# EasyEDA schematic SCH_Universal_Endstop_ZAxis Dumb_2023-11-13.json
TITLE: Sheet_1; REV: 1.0; Date: 2022-06-12; Sheet: 1/1; Drawn By: Edward Niedziejko; Company: Your Company
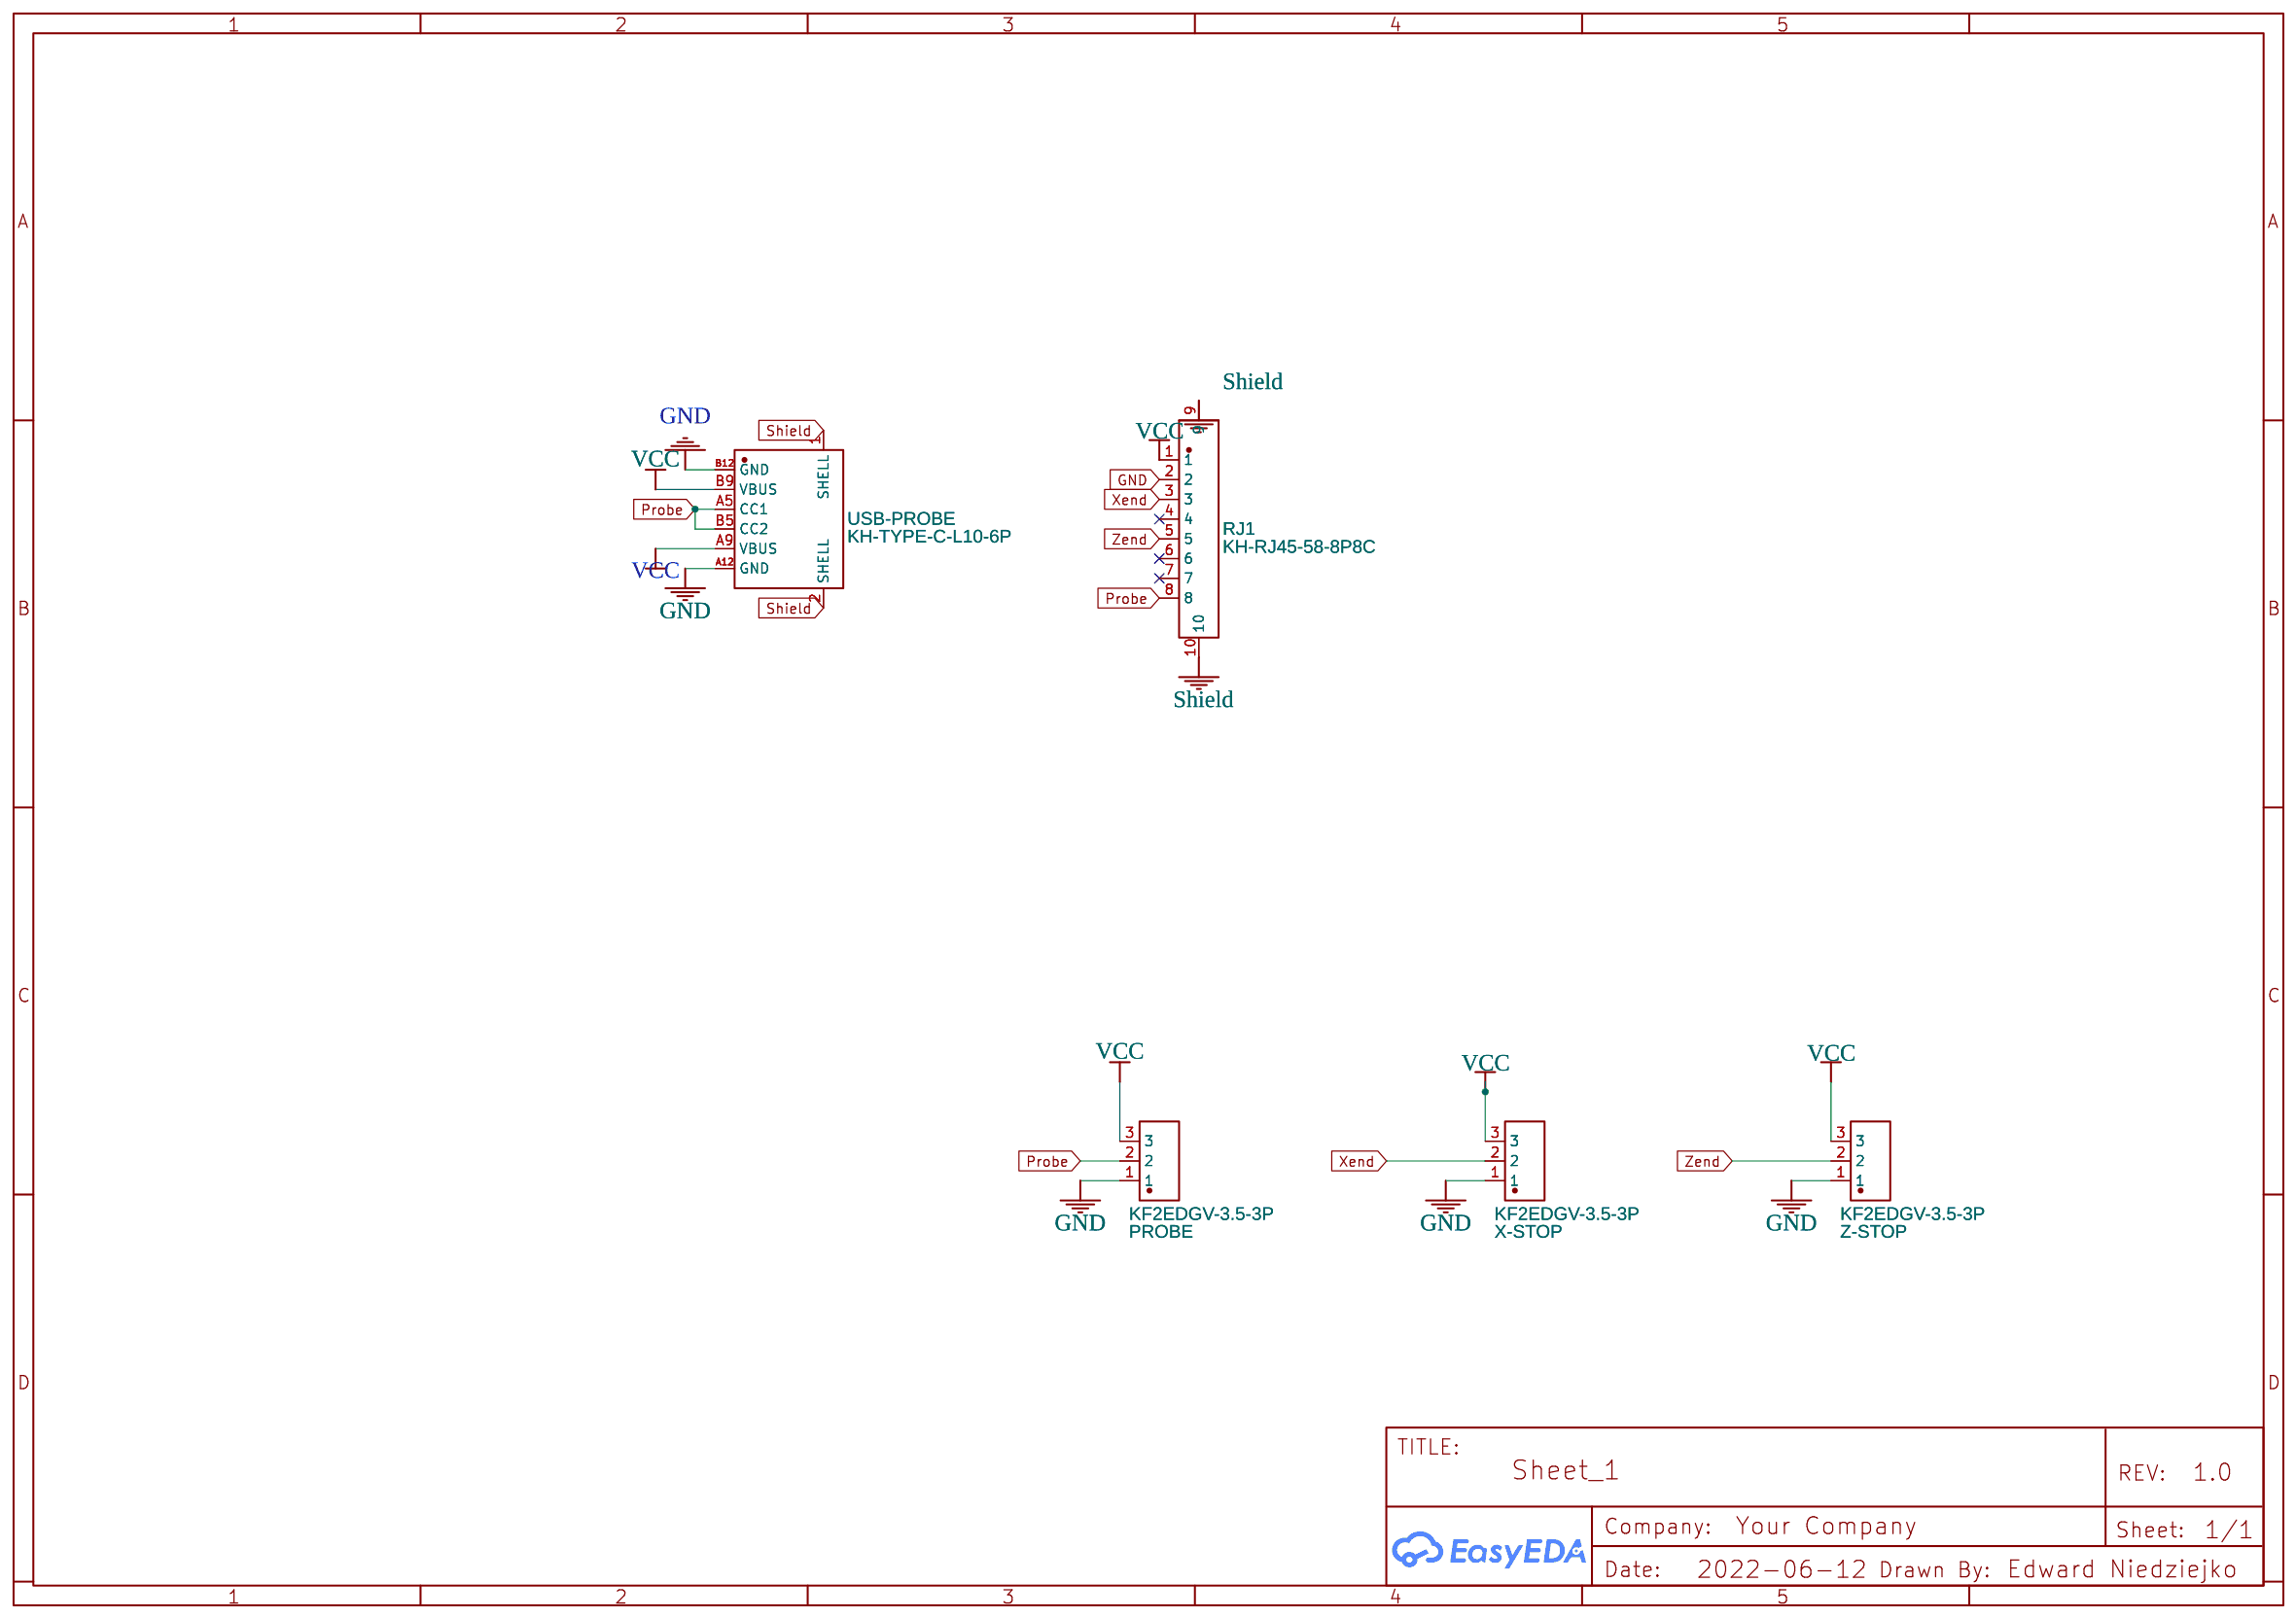
[diagram p0: schematic sheet]

## Parts
PROBE  KF2EDGV-3.5-3P  [CONN-TH_3P-P3.50_KF2EDGV-3.5-3P]
RJ1  KH-RJ45-58-8P8C  [RJ45-TH_KH-RJ45-58-8P8C]
USB-PROBE  KH-TYPE-C-L10-6P  [USB-C-TH_KH-TYPE-C-L10-6P]
X-STOP  KF2EDGV-3.5-3P  [CONN-TH_3P-P3.50_KF2EDGV-3.5-3P]
Z-STOP  KF2EDGV-3.5-3P  [CONN-TH_3P-P3.50_KF2EDGV-3.5-3P]

## Library data of the parts
PROBE X-STOP Z-STOP = KF2EDGV-3.5-3P: Supplier: LCSC; Supplier Part: C441322; Manufacturer: Cixi Kefa Elec; Contributor: LCSC; JLCPCB Part Class: Extended Part
RJ1 = KH-RJ45-58-8P8C: Supplier: LCSC; Supplier Part: C2683360; Manufacturer: kinghelm(金航标); JLCPCB Part Class: Extended Part; Contributor: LCSC
USB-PROBE = KH-TYPE-C-L10-6P: Supplier: LCSC; Supplier Part: C2688788; Manufacturer: kinghelm(金航标); Contributor: LCSC; JLCPCB Part Class: Extended Part

## Nets
GND: PROBE.1 RJ1.2 USB-PROBE.A12(GND) USB-PROBE.B12(GND) X-STOP.1 Z-STOP.1
VCC: PROBE.3 RJ1.1 USB-PROBE.A9(VBUS) USB-PROBE.B9(VBUS) X-STOP.3 Z-STOP.3
Probe: PROBE.2 RJ1.8 USB-PROBE.A5(CC1) USB-PROBE.B5(CC2)
Shield: RJ1.9 RJ1.10 USB-PROBE.1(SHELL) USB-PROBE.2(SHELL)
Xend: RJ1.3 X-STOP.2
Zend: RJ1.5 Z-STOP.2

Not connected (* = marked no-connect by the designer): RJ1 4* 6* 7*
